# Altium schematic sheet PG8_ETHERNET.SchDoc
size A4; Author: Hanxiao; Revision: EVAL_A02; SheetNumber: 8; SheetTotal: 17
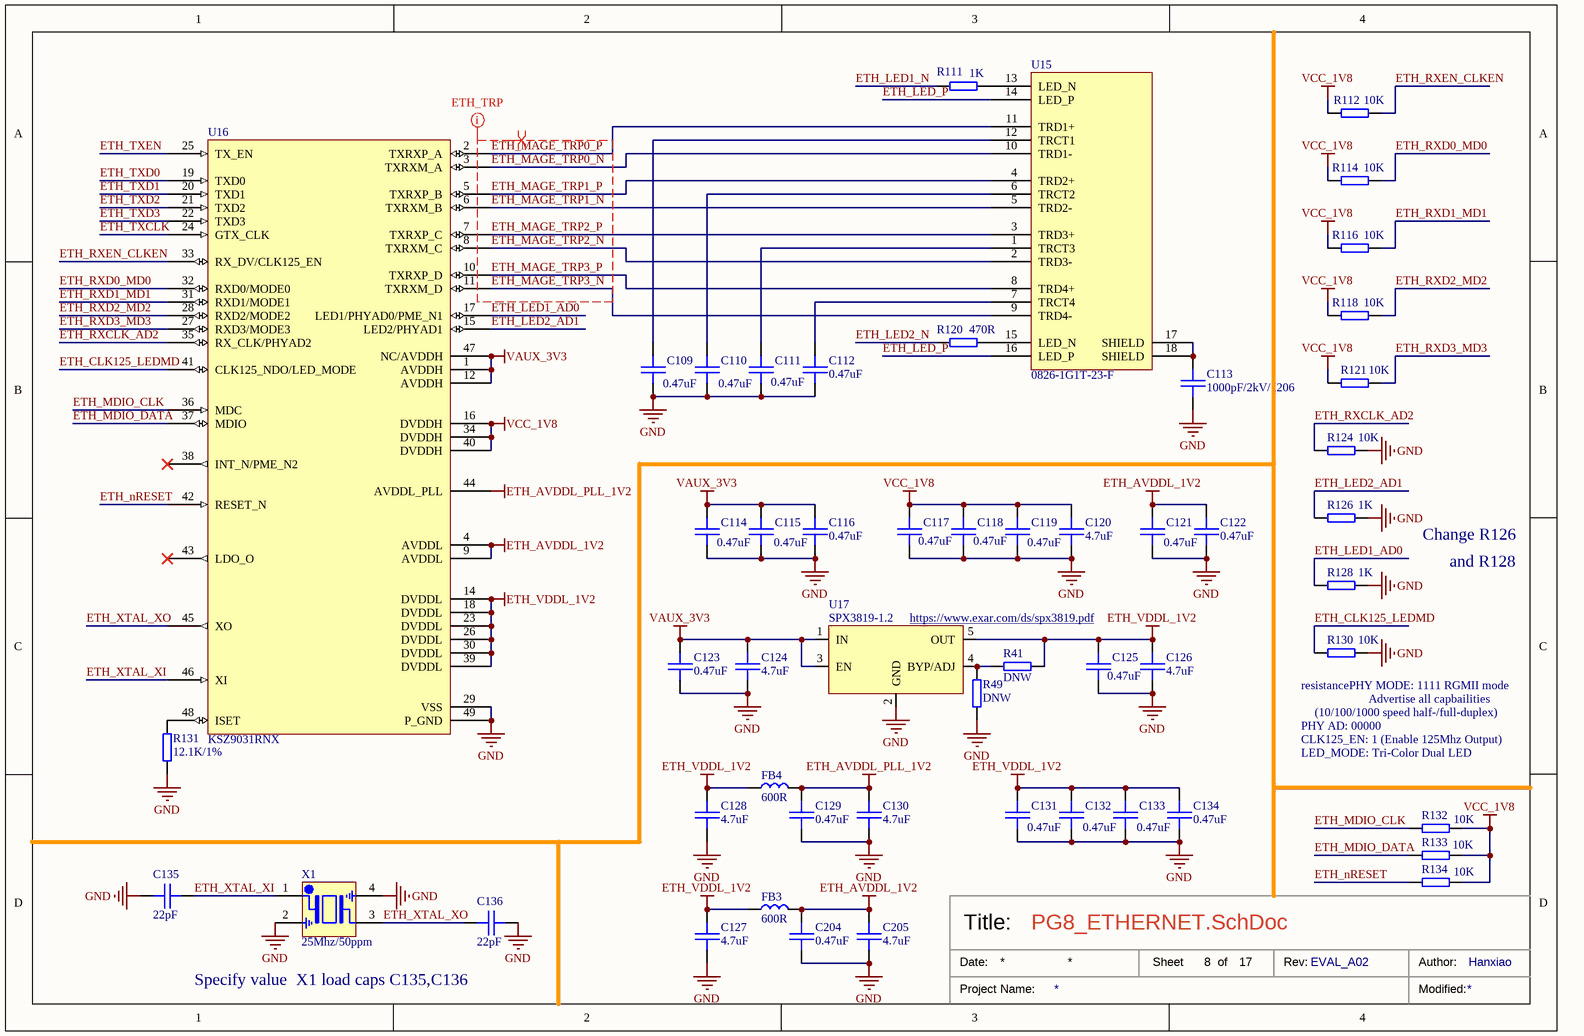
[diagram p0: PG8_ETHERNET.SchDoc]

## Parts
C109  0.47uF  [SMT_C_0402]
C110  0.47uF  [SMT_C_0402]
C111  0.47uF  [SMT_C_0402]
C112  0.47uF  [SMT_C_0402]
C113  1000pF/2kV/1206  [CAPC3212X14N]
C114  0.47uF  [SMT_C_0402]
C115  0.47uF  [SMT_C_0402]
C116  0.47uF  [SMT_C_0402]
C117  0.47uF  [SMT_C_0402]
C118  0.47uF  [SMT_C_0402]
C119  0.47uF  [SMT_C_0402]
C120  4.7uF  [SMT_C_0402]
C121  0.47uF  [SMT_C_0402]
C122  0.47uF  [SMT_C_0402]
C123  0.47uF  [SMT_C_0402]
C124  4.7uF  [SMT_C_0402]
C125  0.47uF  [SMT_C_0402]
C126  4.7uF  [SMT_C_0402]
C127  4.7uF  [SMT_C_0402]
C128  4.7uF  [SMT_C_0402]
C129  0.47uF  [SMT_C_0402]
C130  4.7uF  [SMT_C_0402]
C131  0.47uF  [SMT_C_0402]
C132  0.47uF  [SMT_C_0402]
C133  0.47uF  [SMT_C_0402]
C134  0.47uF  [SMT_C_0402]
C135  22pF  [SMT_C_0402]
C136  22pF  [SMT_C_0402]
C204  0.47uF  [SMT_C_0402]
C205  4.7uF  [SMT_C_0402]
FB3  600R  [SMT_FB_0603]
FB4  600R  [SMT_FB_0603]
R41  DNW  [SMT_R_0402]
R49  DNW  [SMT_R_0402]
R111  1K  [SMT_R_0402]
R112  10K  [SMT_R_0402]
R114  10K  [SMT_R_0402]
R116  10K  [SMT_R_0402]
R118  10K  [SMT_R_0402]
R120  470R  [SMT_R_0402]
R121  10K  [SMT_R_0402]
R124  10K  [SMT_R_0402]
R126  1K  [SMT_R_0402]
R128  1K  [SMT_R_0402]
R130  10K  [SMT_R_0402]
R131  12.1K/1%  [SMT_R_0402]
R132  10K  [SMT_R_0402]
R133  10K  [SMT_R_0402]
R134  10K  [SMT_R_0402]
U15  0826-1G1T-23-F  [0826-1G1T-23-F]
U16  KSZ9031RNX  [QFN50P700X700X90_HS-49L]
U17  SPX3819-1.2  [SOT23-5]
X1  25Mhz/50ppm  [SMT_XTAL_3225]

## Nets
ETH_AVDDL_1V2: C121.1 C122.1 C204.1 C205.1 FB3.1 U16.4(AVDDL) U16.9(AVDDL)
ETH_AVDDL_PLL_1V2: C129.1 C130.1 FB4.1 U16.44(AVDDL_PLL)
ETH_VDDL_1V2: C125.1 C126.1 C127.1 C128.1 C131.1 C132.1 C133.1 C134.1 FB3.2 FB4.2 R41.2 U16.14(DVDDL) U16.18(DVDDL) U16.23(DVDDL) U16.26(DVDDL) U16.30(DVDDL) U16.39(DVDDL) U17.5(OUT)
GND: C109.2 C110.2 C111.2 C112.2 C113.2 C114.2 C115.2 C116.2 C117.2 C118.2 C119.2 C120.2 C121.2 C122.2 C123.2 C124.2 C125.2 C126.2 C127.2 C128.2 C129.2 C130.2 C131.2 C132.2 C133.2 C134.2 C135.1 C136.2 C204.2 C205.2 R49.2 R124.2 R126.2 R128.2 R130.2 R131.2 U16.29(VSS) U16.49(P_GND) U17.2(GND) X1.2(GND) X1.4(GND)
VAUX_3V3: C114.1 C115.1 C116.1 C123.1 C124.1 U16.1(AVDDH) U16.12(AVDDH) U16.47(NC/AVDDH) U17.1(IN) U17.3(EN)
VCC_1V8: C117.1 C118.1 C119.1 C120.1 R112.1 R114.1 R116.1 R118.1 R121.1 R132.2 R133.2 R134.2 U16.16(DVDDH) U16.34(DVDDH) U16.40(DVDDH)
ETH_CLK125_LEDMD: R130.1 U16.41(CLK125_NDO/LED_MODE)
ETH_LED1_AD0: R128.1 U16.17(LED1/PHYAD0/PME_N1)
ETH_LED1_N: R111.2
ETH_LED2_AD1: R126.1 U16.15(LED2/PHYAD1)
ETH_LED2_N: R120.2
ETH_LED_P: U15.14(LED_P) U15.16(LED_P)
ETH_MAGE_TRP0_N: U15.10(TRD1-) U16.3(TXRXM_A)
ETH_MAGE_TRP0_P: U15.11(TRD1+) U16.2(TXRXP_A)
ETH_MAGE_TRP1_N: U15.5(TRD2-) U16.6(TXRXM_B)
ETH_MAGE_TRP1_P: U15.4(TRD2+) U16.5(TXRXP_B)
ETH_MAGE_TRP2_N: U15.2(TRD3-) U16.8(TXRXM_C)
ETH_MAGE_TRP2_P: U15.3(TRD3+) U16.7(TXRXP_C)
ETH_MAGE_TRP3_N: U15.9(TRD4-) U16.11(TXRXM_D)
ETH_MAGE_TRP3_P: U15.8(TRD4+) U16.10(TXRXP_D)
ETH_MDIO_CLK: R132.1 U16.36(MDC)
ETH_MDIO_DATA: R133.1 U16.37(MDIO)
ETH_nRESET: R134.1 U16.42(RESET_N)
ETH_RXCLK_AD2: R124.1 U16.35(RX_CLK/PHYAD2)
ETH_RXD0_MD0: R114.2 U16.32(RXD0/MODE0)
ETH_RXD1_MD1: R116.2 U16.31(RXD1/MODE1)
ETH_RXD2_MD2: R118.2 U16.28(RXD2/MODE2)
ETH_RXD3_MD3: R121.2 U16.27(RXD3/MODE3)
ETH_RXEN_CLKEN: R112.2 U16.33(RX_DV/CLK125_EN)
ETH_TXCLK: U16.24(GTX_CLK)
ETH_TXD0: U16.19(TXD0)
ETH_TXD1: U16.20(TXD1)
ETH_TXD2: U16.21(TXD2)
ETH_TXD3: U16.22(TXD3)
ETH_TXEN: U16.25(TX_EN)
ETH_XTAL_XI: C135.2 U16.46(XI) X1.1(IN/OUT)
ETH_XTAL_XO: C136.1 U16.45(XO) X1.3(IN/OUT)
NetC109_1: C109.1 U15.12(TRCT1)
NetC110_1: C110.1 U15.6(TRCT2)
NetC111_1: C111.1 U15.1(TRCT3)
NetC112_1: C112.1 U15.7(TRCT4)
NetC113_1: C113.1 U15.17(SHIELD) U15.18(SHIELD)
NetR41_1: R41.1 R49.1 U17.4(BYP/ADJ)
NetR111_1: R111.1 U15.13(LED_N)
NetR120_1: R120.1 U15.15(LED_N)
NetR131_1: R131.1 U16.48(ISET)

Not connected (* = marked no-connect by the designer): U16 38(INT_N/PME_N2)* 43(LDO_O)*

## Layout directives
mark named ETH_TRP: ETH_MAGE_TRP0_N, ETH_MAGE_TRP0_P, ETH_MAGE_TRP1_N, ETH_MAGE_TRP1_P, ETH_MAGE_TRP2_N, ETH_MAGE_TRP2_P, ETH_MAGE_TRP3_N, ETH_MAGE_TRP3_P
differential pair: ETH_MAGE_TRP0_N, ETH_MAGE_TRP0_P, ETH_MAGE_TRP1_N, ETH_MAGE_TRP1_P, ETH_MAGE_TRP2_N, ETH_MAGE_TRP2_P, ETH_MAGE_TRP3_N, ETH_MAGE_TRP3_P

## Notes on the sheet
- Change R126
- and R128
- (near U17) https://www.exar.com/ds/spx3819.pdf
- (near R130) resistancePHY MODE: 1111 RGMII mode
- (10/100/1000 speed half-/full-duplex)
- (near R130) Advertise all capbailities
- PHY AD: 00000
- CLK125_EN: 1 (Enable 125Mhz Output)
- LED_MODE: Tri-Color Dual LED
- Specify value  X1 load caps C135,C136
- Date:
- Title:
- Sheet
- of
- Rev:
- Author:
- Project Name:
- Modified:
- Title
- Size:
- A4
- Number:
- Time:
- Revision:
- File:

## Library data of the parts
C109-C112 C114-C136 C204 C205 = SMT_C_0402: Surface mount capacitor 0402
C113 = SMT_C_0805: Surface mount capacitor 1206
FB3 FB4 = SMT_FB_0603: Surface mount ferrite beads 0603
R41 R49 R111 R112 R114 R116 R118 R120 R121 R124 R126 R128 R130-R134 = SMT_R_0402: Surface mount resistor 0402
U16 = KSZ9031RNX: Gigabit Ethernet Transceiver with RGMII / Support
U17 = SPX3819: 500mA, Low-Noise LDO Voltage Regulator
X1 = SMT_XTAL_PASSIVE: Passive crystal